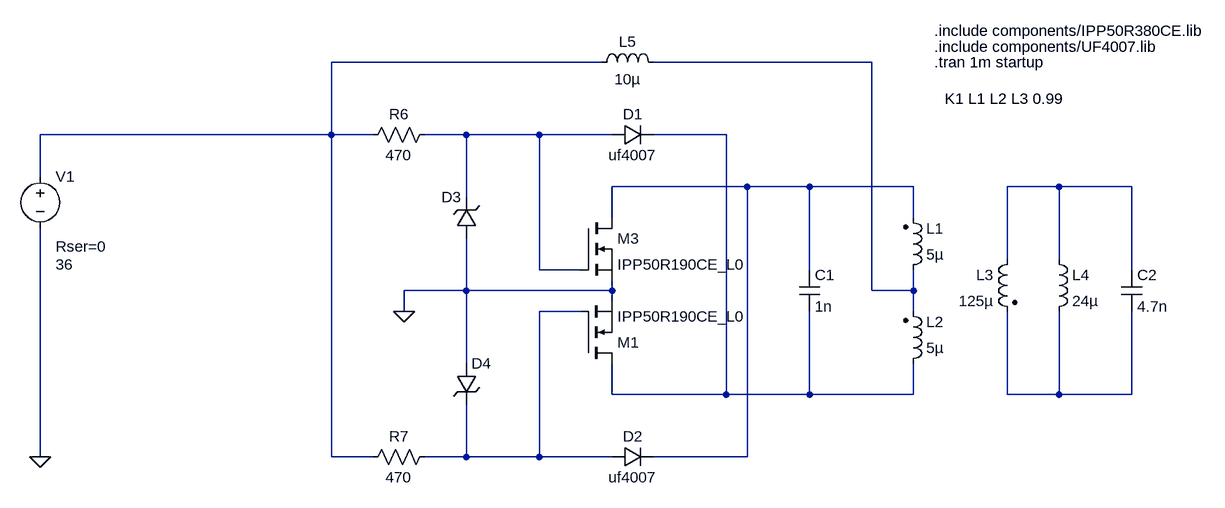
[diagram p0: schematic Baxandall.asc]
Baxandall.asc, the LTspice schematic file:
Version 4
SHEET 1 3964 1160
WIRE 2128 48 1712 48
WIRE 2544 48 2208 48
WIRE 1712 160 1712 48
WIRE 1712 160 1264 160
WIRE 1776 160 1712 160
WIRE 1920 160 1856 160
WIRE 2032 160 1920 160
WIRE 2144 160 2032 160
WIRE 2320 160 2208 160
WIRE 1264 224 1264 160
WIRE 2352 240 2144 240
WIRE 2448 240 2352 240
WIRE 2608 240 2448 240
WIRE 2832 240 2752 240
WIRE 2944 240 2832 240
WIRE 1920 256 1920 160
WIRE 2144 288 2144 240
WIRE 2608 288 2608 240
WIRE 2752 352 2752 240
WIRE 2832 352 2832 240
WIRE 2032 368 2032 160
WIRE 2096 368 2032 368
WIRE 2448 368 2448 240
WIRE 2944 368 2944 240
WIRE 1920 400 1920 320
WIRE 1920 400 1824 400
WIRE 2144 400 2144 384
WIRE 2144 400 1920 400
WIRE 2544 400 2544 48
WIRE 2608 400 2608 368
WIRE 2608 400 2544 400
WIRE 2144 416 2144 400
WIRE 1824 432 1824 400
WIRE 2096 432 2032 432
WIRE 2608 432 2608 400
WIRE 1920 512 1920 400
WIRE 2144 560 2144 512
WIRE 2320 560 2320 160
WIRE 2320 560 2144 560
WIRE 2448 560 2448 432
WIRE 2448 560 2320 560
WIRE 2608 560 2608 512
WIRE 2608 560 2448 560
WIRE 2752 560 2752 432
WIRE 2832 560 2832 432
WIRE 2832 560 2752 560
WIRE 2944 560 2944 432
WIRE 2944 560 2832 560
WIRE 1264 656 1264 304
WIRE 1712 656 1712 160
WIRE 1776 656 1712 656
WIRE 1920 656 1920 576
WIRE 1920 656 1856 656
WIRE 2032 656 2032 432
WIRE 2032 656 1920 656
WIRE 2144 656 2032 656
WIRE 2352 656 2352 240
WIRE 2352 656 2208 656
FLAG 1264 656 0
FLAG 1824 432 0
SYMBOL nmos 2096 512 M180
SYMATTR InstName M1
SYMATTR Value IPP50R190CE_L0
SYMATTR Prefix X
SYMBOL voltage 1264 208 R0
WINDOW 123 0 0 Left 0
WINDOW 39 24 124 Left 2
WINDOW 3 24 152 Left 2
SYMATTR SpiceLine Rser=0
SYMATTR Value 36
SYMATTR InstName V1
SYMBOL ind2 2592 384 M180
WINDOW 0 36 80 Left 2
WINDOW 3 36 40 Left 2
SYMATTR InstName L1
SYMATTR Value 5µ
SYMATTR SpiceLine Rser=0.001
SYMBOL ind2 2592 528 M180
WINDOW 0 36 80 Left 2
WINDOW 3 36 40 Left 2
SYMATTR InstName L2
SYMATTR Value 5µ
SYMATTR SpiceLine Rser=0.001
SYMBOL ind 2816 336 R0
SYMATTR InstName L4
SYMATTR Value 24µ
SYMATTR SpiceLine Ipk=20 Rser=0.01 Rpar=0 Cpar=0
SYMBOL ind 2112 64 R270
WINDOW 0 32 56 VTop 2
WINDOW 3 5 56 VBottom 2
SYMATTR InstName L5
SYMATTR Value 10µ
SYMATTR SpiceLine Ipk=32 Rser=0.00567 Rpar=13284 Cpar=14.992p
SYMBOL nmos 2096 288 R0
SYMATTR InstName M3
SYMATTR Value IPP50R190CE_L0
SYMATTR Prefix X
SYMBOL cap 2928 368 R0
SYMATTR InstName C2
SYMATTR Value 4.7n
SYMATTR SpiceLine V=630 Irms=0 Rser=1m Lser=0
SYMBOL zener 1936 320 R180
WINDOW 0 24 64 Left 2
WINDOW 3 24 0 Invisible 2
SYMATTR InstName D3
SYMATTR Value TFZV16B
SYMBOL zener 1904 512 R0
WINDOW 3 -96 69 Invisible 2
SYMATTR Value TFZV16B
SYMATTR InstName D4
SYMBOL res 1872 144 R90
WINDOW 0 0 56 VBottom 2
WINDOW 3 32 56 VTop 2
SYMATTR InstName R6
SYMATTR Value 470
SYMBOL res 1872 640 R90
WINDOW 0 0 56 VBottom 2
WINDOW 3 32 56 VTop 2
SYMATTR InstName R7
SYMATTR Value 470
SYMBOL ind2 2768 336 M0
SYMATTR InstName L3
SYMATTR Value 125µ
SYMATTR SpiceLine Rser=0.005
SYMBOL diode 2144 176 R270
WINDOW 0 32 32 VTop 2
WINDOW 3 0 32 VBottom 2
SYMATTR InstName D1
SYMATTR Value uf4007
SYMATTR Prefix X
SYMBOL diode 2144 672 R270
WINDOW 0 32 32 VTop 2
WINDOW 3 0 32 VBottom 2
SYMATTR InstName D2
SYMATTR Value uf4007
SYMATTR Prefix X
SYMBOL cap 2432 368 R0
SYMATTR InstName C1
SYMATTR Value 1n
SYMATTR SpiceLine V=630 Irms=0 Rser=1m Lser=0
TEXT 2640 24 Left 2 !.include components/UF4007.lib
TEXT 2640 48 Left 2 !.tran 1m startup
TEXT 2656 104 Left 2 !K1 L1 L2 L3 0.99
TEXT 2640 0 Left 2 !.include components/IPP50R380CE.lib

The netlist it stands for:
* Baxandall.asc
XM1 N004 N007 0 IPP50R190CE_L0  ; pins D G S
V1 N001 0 36 Rser=0
L1 N002 N005 5µ Rser=0.001
L2 N004 N002 5µ Rser=0.001
L4 N006 N008 24µ Ipk=20 Rser=0.01 Rpar=0 Cpar=0
L5 N001 N002 10µ Ipk=32 Rser=0.00567 Rpar=13284 Cpar=14.992p
XM3 N005 N003 0 IPP50R190CE_L0  ; pins D G S
C2 N006 N008 4.7n V=630 Irms=0 Rser=1m Lser=0
D3 0 N003 TFZV16B
D4 0 N007 TFZV16B
R6 N003 N001 470
R7 N007 N001 470
L3 N006 N008 125µ Rser=0.005
XD1 N003 N004 uf4007  ; pins + -
XD2 N007 N005 uf4007  ; pins + -
C1 N005 N004 1n V=630 Irms=0 Rser=1m Lser=0
.model D D
.lib standard.dio
.include components/UF4007.lib
.tran 1m startup
K1 L1 L2 L3 0.99
.include components/IPP50R380CE.lib
.backanno
.end